# EasyEDA schematic SCH_Блок-управления-01.01_2025-02-13.json
TITLE: Sheet_1; REV: 1.0; Date: 2025-02-13; Sheet: 1/1; Drawn By: electrical_department_emp; Company: Your Company
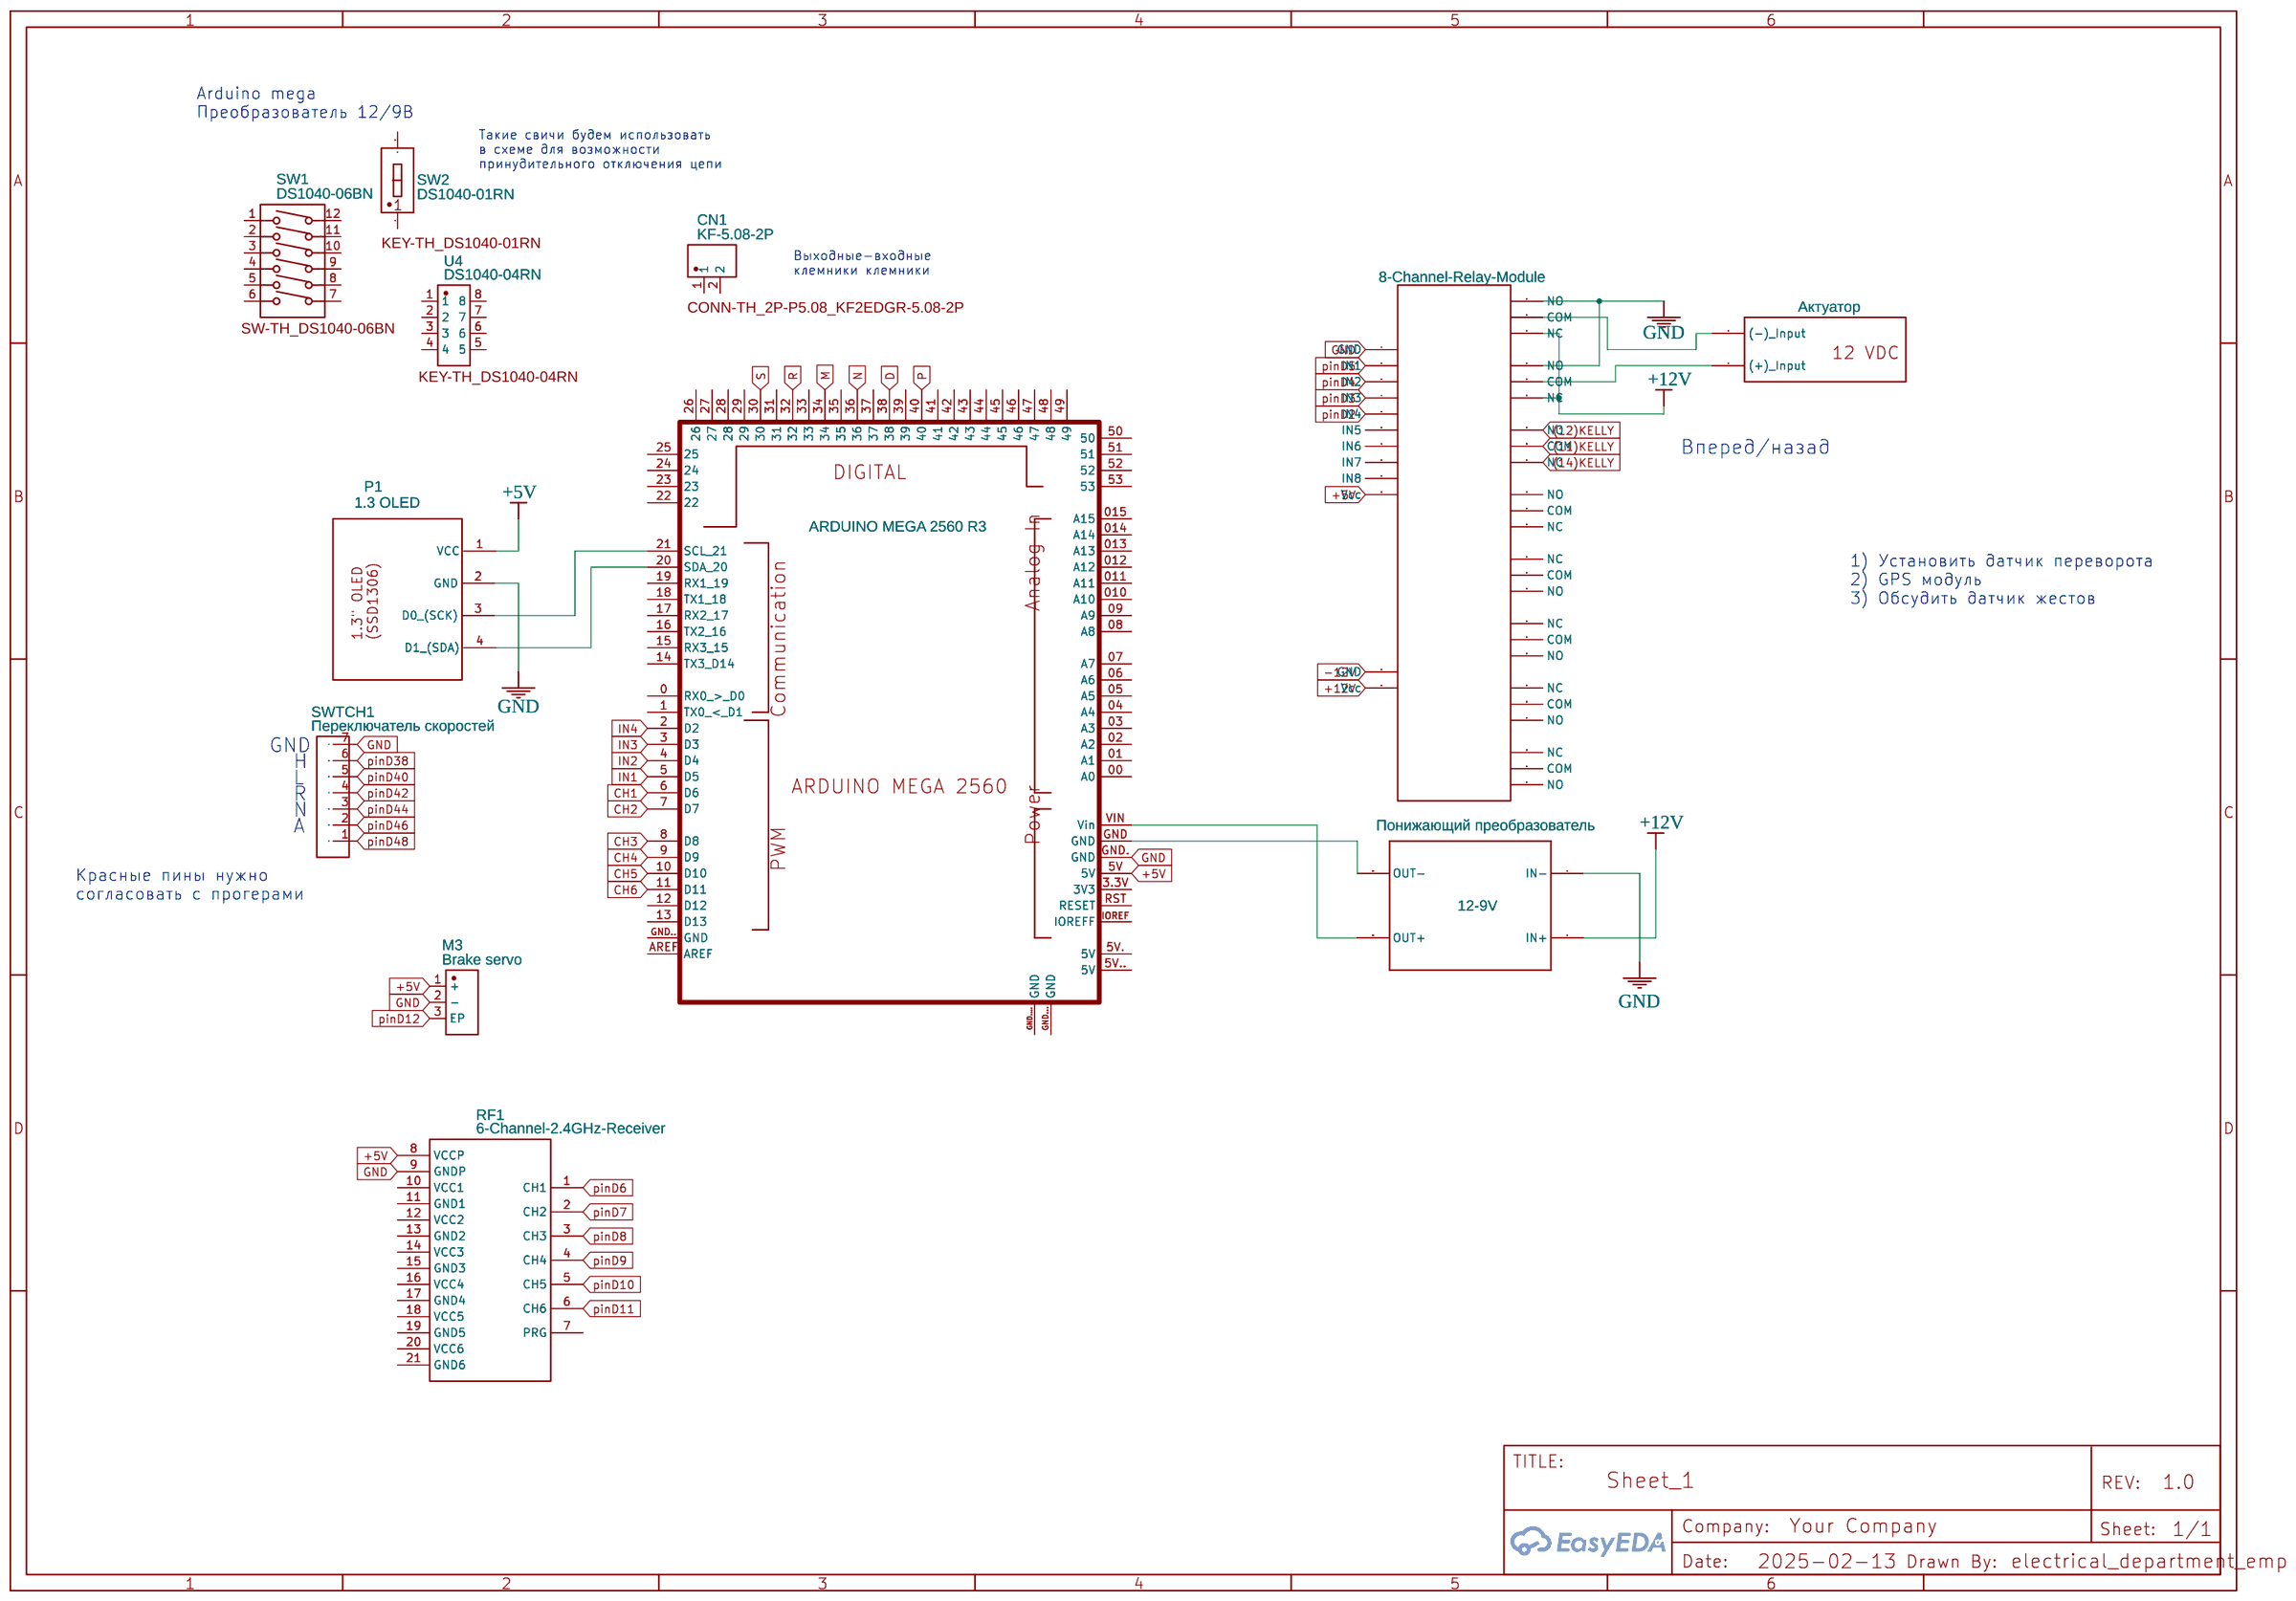
[diagram p0: schematic sheet]

## Parts
12-9V  Понижающий преобразователь  [DC-DC-STEP-DOWN-LM2596]
CN1  KF-5.08-2P  [CONN-TH_2P-P5.08_KF2EDGR-5.08-2P]
M3  Brake servo  [VIBRATING-MOTOR-SMD_3P-C9900001680]
P1  1.3 OLED  [SSD1306]
RF1  6-Channel-2.4GHz-Receiver  [6-CHANNEL-2.4GHZ-RECEIVER]
SW1  DS1040-06BN  [SW-TH_DS1040-06BN]
SW2  DS1040-01RN  [KEY-TH_DS1040-01RN]
SWTCH1  Переключатель скоростей  [PINHEADER_07X1]
U1  8-Channel-Relay-Module
U2  ARDUINO MEGA 2560 R3  [TWIX_MEGA_PCB____ARDUINO-MEGA2560-FOOTPRINT_]
U3  Актуатор  [ACTUATOR IN]
U4  DS1040-04RN  [KEY-TH_DS1040-04RN]

## Library data of the parts
12-9V = DC-DC-STEP-DOWN-LM2596: Contributor: Sab Bah
CN1 = KF-5.08-2P: Contributor: lcsc; Supplier: LCSC; Supplier Part: C9900027137; Manufacturer: null; Package Display: Yes
M3 = Z3OC1T8219731: Contributor: LCSC; Supplier: LCSC; Supplier Part: C2894731; Manufacturer: KOTL(金龙机电); JLCPCB Part Class: Extended Part
P1 = 1.3 OLED copy: sourceId: yK0HAabLc; Supplier: Brainy Bits
RF1 = 6-Channel-2.4GHz-Receiver: Contributor: Víctor Peinado López
SW1 = DS1040-06BN: Supplier: LCSC; Supplier Part: C3040969; Manufacturer: CONNFLY; Contributor: lcsc; Package Display: Yes
SW2 = DS1040-01RN: Supplier: LCSC; Supplier Part: C3024967; Manufacturer: CONNFLY; JLCPCB Part Class: Extended Part; Contributor: lcsc; Package Display: Yes
SWTCH1 = pinheader07x1: Manufacturer Part: Header 6x1; Contributor: s1atbewie.de
U1 = 8-Channel-Relay-Module: Manufacturer Part: 4-Channel-Relay-Module; Contributor: Prince1234; Mounted: No
U2 = ARDUINO MEGA 2560 R3 WITH 3D MODEL: Manufacturer: Ricardo; Contributor: Riki99
U3 = ACTUATOR INPUT COPY: Contributor: Matty87
U4 = DS1040-04RN: Contributor: lcsc; Supplier: LCSC; Supplier Part: C3024970; Manufacturer: CONNFLY; JLCPCB Part Class: Extended Part; Package Display: Yes

## Nets
+5V: M3.1(+) P1.1(VCC) RF1.8(VCCP) U2.5V
+12V: 12-9V.IN+ U1.11(NC)
GND: 12-9V.IN- M3.2(-) P1.2(GND) RF1.9(GNDP) SWTCH1.7 U1.9(NO) U2.GND.(GND)
CH1: U2.6(D6)
CH2: U2.7(D7)
CH3: U2.8(D8)
CH4: U2.9(D9)
CH5: U2.10(D10)
CH6: U2.11(D11)
D: U2.38
IN1: U2.5(D5)
IN2: U2.4(D4)
IN3: U2.3(D3)
IN4: U2.2(D2)
M: U2.34
N: U2.36
P: U2.40
pinD6: RF1.1(CH1)
pinD7: RF1.2(CH2)
pinD8: RF1.3(CH3)
pinD9: RF1.4(CH4)
pinD10: RF1.5(CH5)
pinD11: RF1.6(CH6)
pinD12: M3.3(EP)
pinD38: SWTCH1.6
pinD40: SWTCH1.5
pinD42: SWTCH1.4
pinD44: SWTCH1.3
pinD46: SWTCH1.2
pinD48: SWTCH1.1
R: U2.32
S: U2.30
Net-(12-9V-OUT+): 12-9V.OUT+ U2.VIN(Vin)
Net-(12-9V-OUT-): 12-9V.OUT- U2.GND
Net-(P1-3): P1.3(D0 (SCK)) U2.21(SCL 21)
Net-(P1-4): P1.4(D1 (SDA)) U2.20(SDA 20)
Net-(U1-10): U1.10(NO) U3.1((+) Input) U3.2((-) Input)

Not connected (* = marked no-connect by the designer): CN1 1 2; RF1 7(PRG) 10(VCC1) 11(GND1) 12(VCC2) 13(GND2) 14(VCC3) 15(GND3) 16(VCC4) 17(GND4) 18(VCC5) 19(GND5) 20(VCC6) 21(GND6); SW1 1 2 3 4 5 6 7 8 9 10 11 12; SW2 1 2; U1 1(GND) 2(IN1) 3(IN2) 4(IN3) 5(IN8) 6(Vcc); U2 00(A0) 0(RX0 > D0) 01(A1) 1(TX0 < D1) 02(A2) 03(A3) 3.3V(3V3) 04(A4) 05(A5) 5V.(5V) 5V..(5V) 06(A6) 07(A7) 08(A8) 09(A9) 010(A10) 011(A11) 012(A12) 12(D12) 013(A13) 13(D13) 014(A14) 14(TX3 D14) 015(A15) 15(RX3 15) 16(TX2 16) 17(RX2 17) 18(TX1 18) 19(RX1 19) 22 23 24 25 26 27 28 29 31 33 35 37 39 41 42 43 44 45 46 47 48 49 50 51 52 53 AREF GND..(GND) GND...(GND) GND....(GND) IOREF(IOREFF) RST(RESET); U4 1 2 3 4 5 6 7 8

## Notes on the sheet
- Arduino mega
  Преобразователь 12/9В
- Такие свичи будем использовать
  в схеме для возможности
  принудительного отключения цепи
- Выходные-входные
  клемники клемники
- Вперед/назад
- 1) Установить датчик переворота
  2) GPS модуль
  3) Обсудить датчик жестов
- GND
- H
- L
- R
- A
- N
- Красные пины нужно
  согласовать с прогерами
